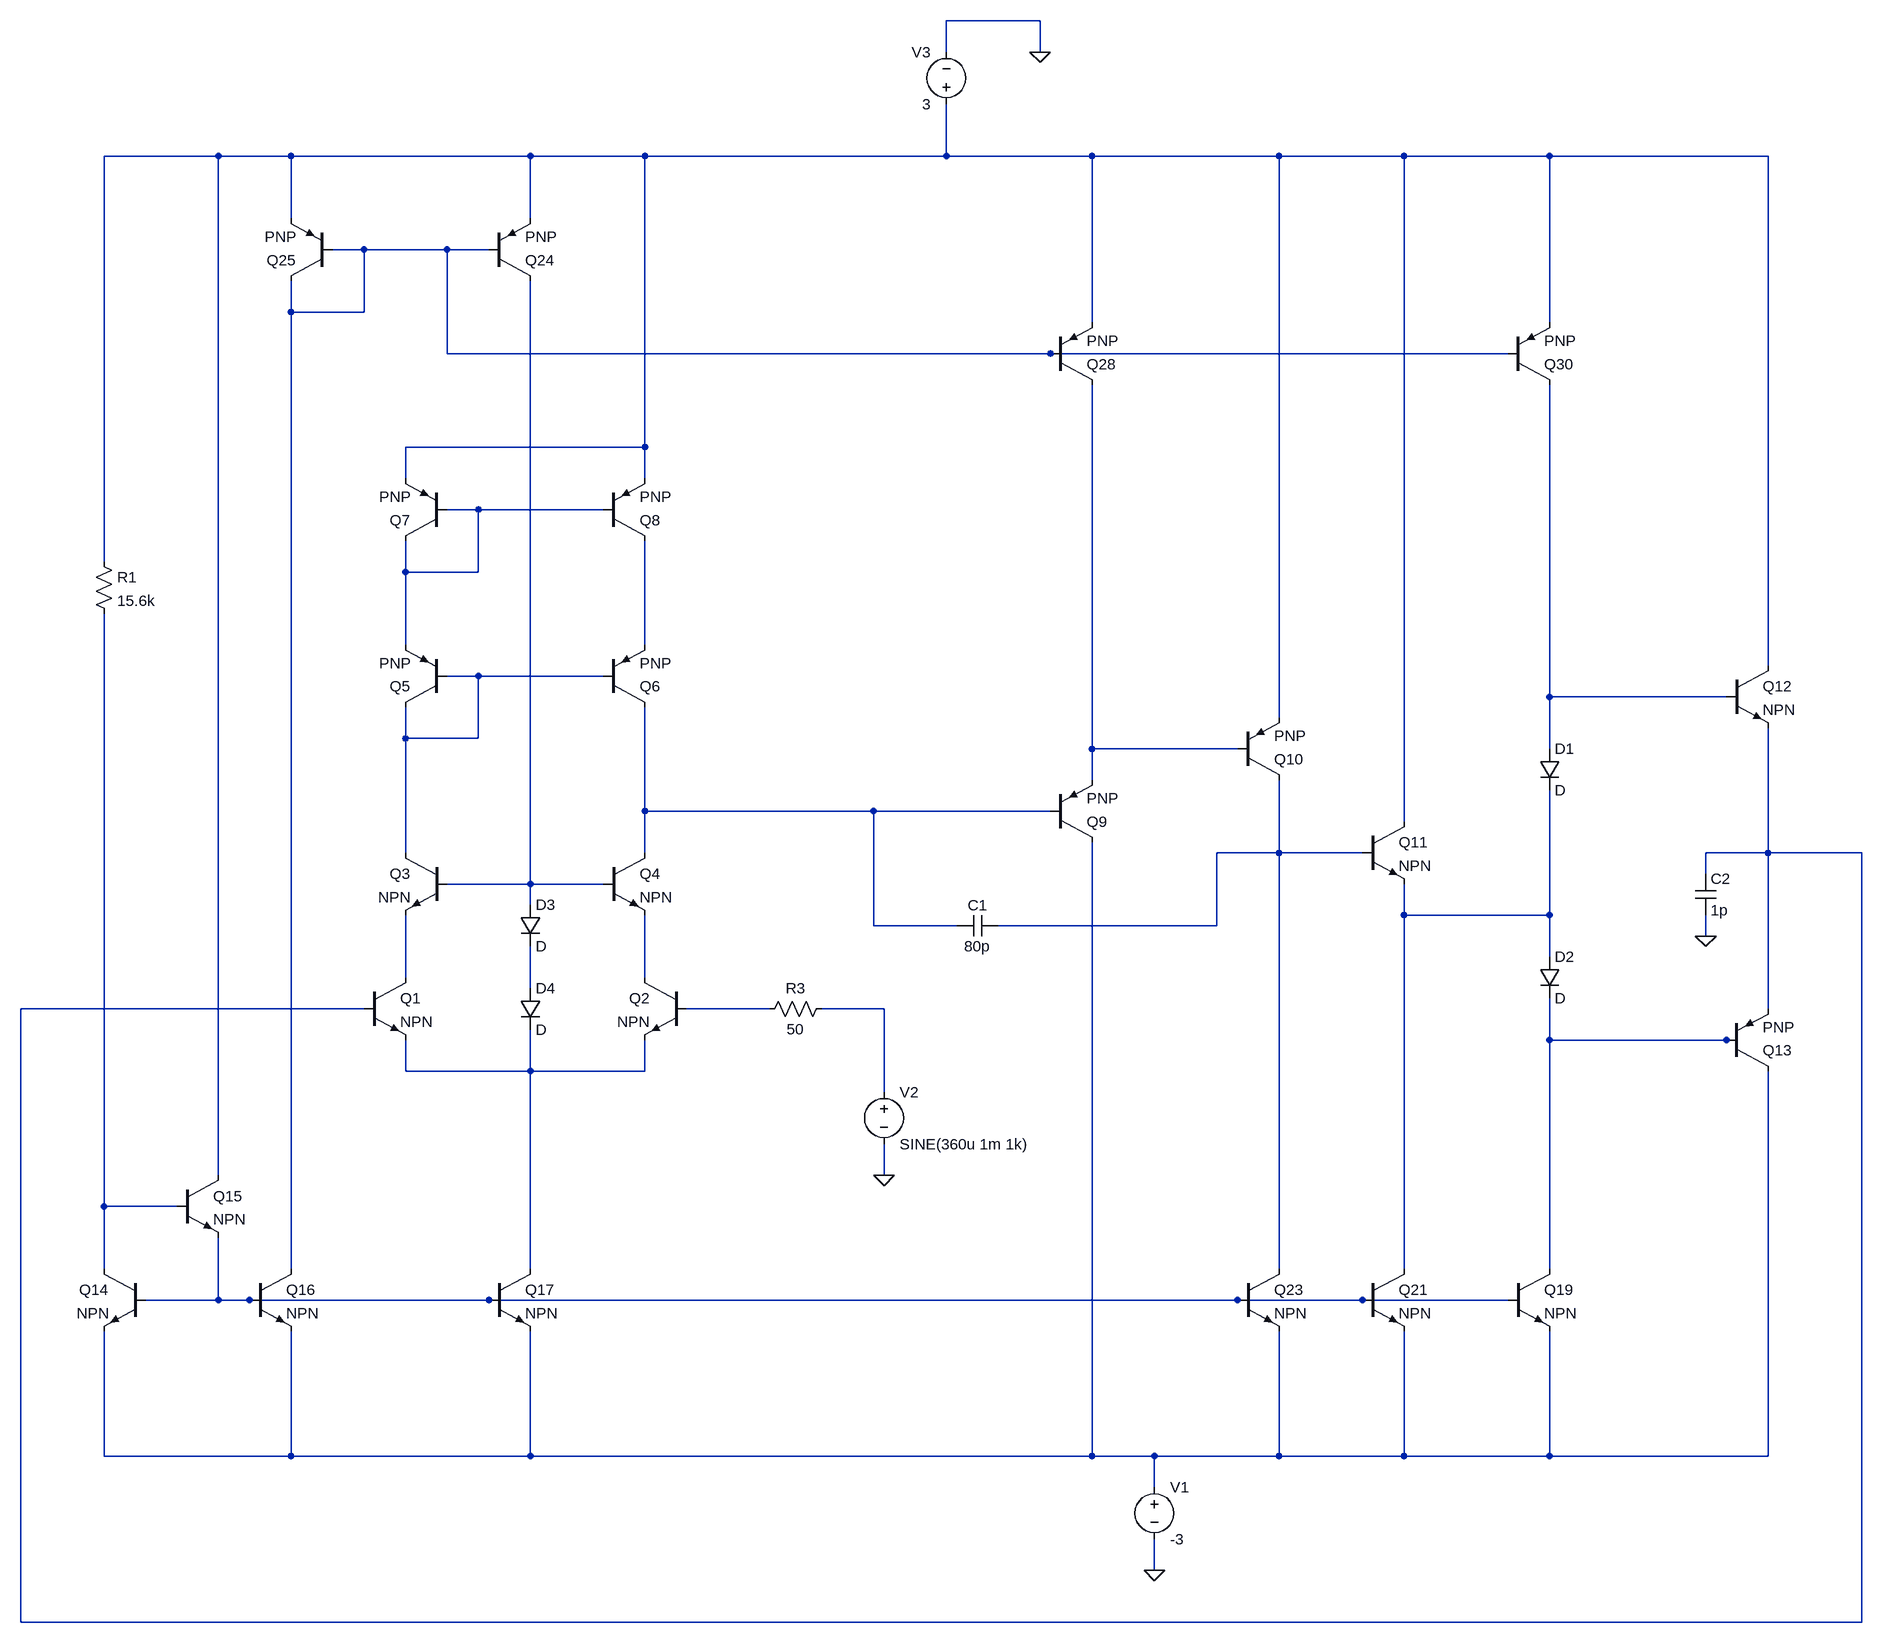
[diagram p0: schematic project_pro.asc]
project_pro.asc, the LTspice schematic file:
Version 4
SHEET 1 2292 1192
WIRE 1024 -1280 880 -1280
WIRE 880 -1232 880 -1280
WIRE 1024 -1232 1024 -1280
WIRE -240 -1072 -416 -1072
WIRE -128 -1072 -240 -1072
WIRE 240 -1072 -128 -1072
WIRE 416 -1072 240 -1072
WIRE 880 -1072 880 -1152
WIRE 880 -1072 416 -1072
WIRE 1104 -1072 880 -1072
WIRE 1392 -1072 1104 -1072
WIRE 1584 -1072 1392 -1072
WIRE 1808 -1072 1584 -1072
WIRE 2144 -1072 1808 -1072
WIRE -128 -976 -128 -1072
WIRE 240 -976 240 -1072
WIRE -16 -928 -64 -928
WIRE 112 -928 -16 -928
WIRE 176 -928 112 -928
WIRE -128 -832 -128 -880
WIRE -16 -832 -16 -928
WIRE -16 -832 -128 -832
WIRE 1104 -816 1104 -1072
WIRE 1808 -816 1808 -1072
WIRE 112 -768 112 -928
WIRE 1040 -768 112 -768
WIRE 1744 -768 1040 -768
WIRE 416 -624 416 -1072
WIRE 416 -624 48 -624
WIRE 48 -576 48 -624
WIRE 416 -576 416 -624
WIRE 160 -528 112 -528
WIRE 352 -528 160 -528
WIRE -416 -448 -416 -1072
WIRE 48 -432 48 -480
WIRE 160 -432 160 -528
WIRE 160 -432 48 -432
WIRE 48 -320 48 -432
WIRE 416 -320 416 -480
WIRE 2144 -288 2144 -1072
WIRE 160 -272 112 -272
WIRE 352 -272 160 -272
WIRE 1808 -240 1808 -720
WIRE 2080 -240 1808 -240
WIRE 1392 -208 1392 -1072
WIRE 48 -176 48 -224
WIRE 160 -176 160 -272
WIRE 160 -176 48 -176
WIRE 1104 -160 1104 -720
WIRE 1328 -160 1104 -160
WIRE 1808 -160 1808 -240
WIRE 1104 -112 1104 -160
WIRE 416 -64 416 -224
WIRE 768 -64 416 -64
WIRE 1040 -64 768 -64
WIRE 1584 -48 1584 -1072
WIRE 48 0 48 -176
WIRE 416 0 416 -64
WIRE 1392 0 1392 -112
WIRE 1392 0 1296 0
WIRE 1520 0 1392 0
WIRE 2144 0 2144 -192
WIRE 2144 0 2048 0
WIRE 2288 0 2144 0
WIRE 2048 32 2048 0
WIRE 240 48 240 -880
WIRE 240 48 112 48
WIRE 352 48 240 48
WIRE 240 80 240 48
WIRE 1584 96 1584 48
WIRE 1808 96 1808 -96
WIRE 1808 96 1584 96
WIRE 768 112 768 -64
WIRE 896 112 768 112
WIRE 1296 112 1296 0
WIRE 1296 112 960 112
WIRE 2048 128 2048 96
WIRE 1808 160 1808 96
WIRE 48 192 48 96
WIRE 416 192 416 96
WIRE 240 208 240 144
WIRE -16 240 -544 240
WIRE 608 240 480 240
WIRE 784 240 688 240
WIRE 2144 240 2144 0
WIRE 1808 288 1808 224
WIRE 2080 288 1808 288
WIRE 2096 288 2080 288
WIRE 48 336 48 288
WIRE 240 336 240 272
WIRE 240 336 48 336
WIRE 416 336 416 288
WIRE 416 336 240 336
WIRE 784 368 784 240
WIRE -240 496 -240 -1072
WIRE 784 496 784 448
WIRE -416 544 -416 -368
WIRE -304 544 -416 544
WIRE -416 640 -416 544
WIRE -128 640 -128 -832
WIRE 240 640 240 336
WIRE 1392 640 1392 0
WIRE 1584 640 1584 96
WIRE 1808 640 1808 288
WIRE -240 688 -240 592
WIRE -240 688 -352 688
WIRE -192 688 -240 688
WIRE 176 688 -192 688
WIRE 1328 688 176 688
WIRE 1520 688 1328 688
WIRE 1744 688 1520 688
WIRE -416 928 -416 736
WIRE -128 928 -128 736
WIRE -128 928 -416 928
WIRE 240 928 240 736
WIRE 240 928 -128 928
WIRE 1104 928 1104 -16
WIRE 1104 928 240 928
WIRE 1200 928 1104 928
WIRE 1392 928 1392 736
WIRE 1392 928 1200 928
WIRE 1584 928 1584 736
WIRE 1584 928 1392 928
WIRE 1808 928 1808 736
WIRE 1808 928 1584 928
WIRE 2144 928 2144 336
WIRE 2144 928 1808 928
WIRE 1200 976 1200 928
WIRE 1200 1104 1200 1056
WIRE -544 1184 -544 240
WIRE 2288 1184 2288 0
WIRE 2288 1184 -544 1184
FLAG 2048 128 0
FLAG 1200 1104 0
FLAG 784 496 0
FLAG 1024 -1232 0
SYMBOL npn -16 192 R0
SYMATTR InstName Q1
SYMBOL npn 480 192 M0
SYMATTR InstName Q2
SYMBOL pnp 352 -480 M180
SYMATTR InstName Q8
SYMBOL pnp 112 -480 R180
SYMATTR InstName Q7
SYMBOL pnp 1040 -16 M180
SYMATTR InstName Q9
SYMBOL pnp 1328 -112 M180
SYMATTR InstName Q10
SYMBOL npn 1520 -48 R0
SYMATTR InstName Q11
SYMBOL diode 1792 -160 R0
SYMATTR InstName D1
SYMBOL diode 1792 160 R0
SYMATTR InstName D2
SYMBOL npn 2080 -288 R0
SYMATTR InstName Q12
SYMBOL cap 2032 32 R0
SYMATTR InstName C2
SYMATTR Value 1p
SYMBOL pnp 2080 336 M180
SYMATTR InstName Q13
SYMBOL pnp 352 -224 M180
SYMATTR InstName Q6
SYMBOL pnp 112 -224 R180
SYMATTR InstName Q5
SYMBOL npn 112 0 M0
SYMATTR InstName Q3
SYMBOL npn 352 0 R0
SYMATTR InstName Q4
SYMBOL diode 224 80 R0
SYMATTR InstName D3
SYMBOL diode 224 208 R0
SYMATTR InstName D4
SYMBOL voltage 1200 960 R0
WINDOW 123 0 0 Left 0
WINDOW 39 0 0 Left 0
SYMATTR InstName V1
SYMATTR Value -3
SYMBOL cap 960 96 R90
WINDOW 0 0 32 VBottom 2
WINDOW 3 32 32 VTop 2
SYMATTR InstName C1
SYMATTR Value 80p
SYMBOL npn 1744 640 R0
SYMATTR InstName Q19
SYMBOL npn 1520 640 R0
SYMATTR InstName Q21
SYMBOL npn 1328 640 R0
SYMATTR InstName Q23
SYMBOL voltage 784 352 R0
WINDOW 123 0 0 Left 0
WINDOW 39 0 0 Left 0
SYMATTR InstName V2
SYMATTR Value SINE(360u 1m 1k)
SYMBOL pnp 176 -880 M180
SYMATTR InstName Q24
SYMBOL pnp -64 -880 R180
SYMATTR InstName Q25
SYMBOL pnp 1744 -720 M180
SYMATTR InstName Q30
SYMBOL voltage 880 -1136 R180
WINDOW 0 24 96 Left 2
WINDOW 3 24 16 Left 2
WINDOW 123 0 0 Left 0
WINDOW 39 0 0 Left 0
SYMATTR InstName V3
SYMATTR Value 3
SYMBOL pnp 1040 -720 M180
SYMATTR InstName Q28
SYMBOL res 704 224 R90
WINDOW 0 0 56 VBottom 2
WINDOW 3 32 56 VTop 2
SYMATTR InstName R3
SYMATTR Value 50
SYMBOL npn -352 640 M0
SYMATTR InstName Q14
SYMBOL npn -304 496 R0
SYMATTR InstName Q15
SYMBOL npn -192 640 R0
SYMATTR InstName Q16
SYMBOL npn 176 640 R0
SYMATTR InstName Q17
SYMBOL res -432 -464 R0
SYMATTR InstName R1
SYMATTR Value 15.6k

The netlist it stands for:
* project_pro.asc
Q1 N013 N010 N019 0 NPN
Q2 N014 N016 N019 0 NPN
Q8 N004 N003 N001 0 PNP
Q7 N003 N003 N001 0 PNP
Q9 N022 N008 N007 0 PNP
Q10 N009 N007 N001 0 PNP
Q11 N001 N009 N012 0 NPN
D1 N006 N012 D
D2 N012 N018 D
Q12 N001 N006 N010 0 NPN
C2 N010 0 1p
Q13 N022 N018 N010 0 PNP
Q6 N008 N005 N004 0 PNP
Q5 N005 N005 N003 0 PNP
Q3 N005 N011 N013 0 NPN
Q4 N008 N011 N014 0 NPN
D3 N011 N015 D
D4 N015 N019 D
V1 N022 0 -3
C1 N009 N008 80p
Q19 N018 N021 N022 0 NPN
Q21 N012 N021 N022 0 NPN
Q23 N009 N021 N022 0 NPN
V2 N017 0 SINE(360u 1m 1k)
Q24 N011 N002 N001 0 PNP
Q25 N002 N002 N001 0 PNP
Q30 N006 N002 N001 0 PNP
V3 N001 0 3
Q28 N007 N002 N001 0 PNP
R3 N017 N016 50
Q14 N020 N021 N022 0 NPN
Q15 N001 N020 N021 0 NPN
Q16 N002 N021 N022 0 NPN
Q17 N019 N021 N022 0 NPN
R1 N001 N020 15.6k
.model D D
.lib standard.dio
.model NPN NPN
.model PNP PNP
.lib standard.bjt
.backanno
.end